# Altium schematic sheet Esquematico_Luximetro.SchDoc
size A4
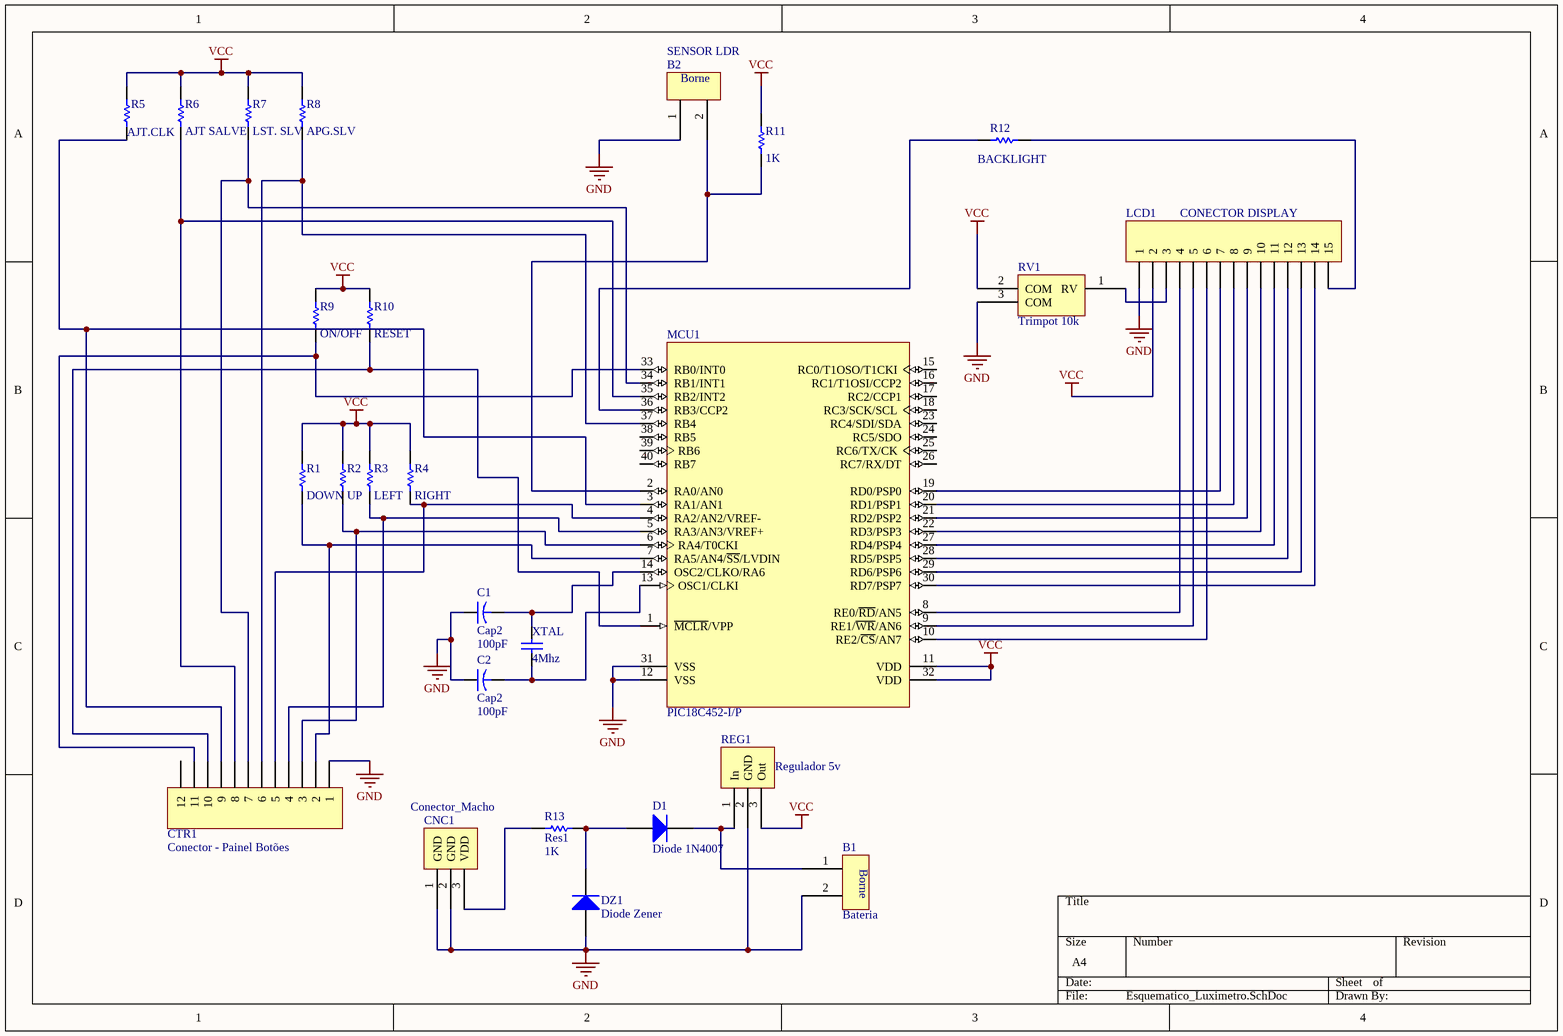
[diagram p0: Esquematico_Luximetro.SchDoc]

## Parts
B1  Bateria  [PCB_BORNE]
B2  SENSOR LDR  [PCB_BORNE]
C1  Cap2  value 100pF  [CAPR5-4X5]
C2  Cap2  value 100pF  [CAPR5-4X5]
CNC1  Conector_Macho  [PCB_Conector]
CTR1  Conector - Painel Botões  [HDR1X12]
D1  Diode 1N4007  [DO-41]
DZ1  Diode Zener  [DO-41]
LCD1  CONECTOR DISPLAY  [HDR1X15]
MCU1  PIC18C452-I/P  [PDIP600-40]
R1  value DOWN  [AXIAL-0.3]  (hidden comment: Res2)
R2  value UP  [AXIAL-0.3]  (hidden comment: Res3)
R3  value LEFT  [AXIAL-0.3]  (hidden comment: Res4)
R4  value RIGHT  [AXIAL-0.3]  (hidden comment: Res5)
R5  value AJT.CLK  [AXIAL-0.3]  (hidden comment: Res1)
R6  value AJT SALVE  [AXIAL-0.3]  (hidden comment: Res1)
R7  value LST. SLV  [AXIAL-0.3]  (hidden comment: Res1)
R8  value APG.SLV  [AXIAL-0.3]  (hidden comment: Res1)
R9  value ON/OFF  [AXIAL-0.3]  (hidden comment: Res1)
R10  value RESET  [AXIAL-0.3]  (hidden comment: Res1)
R11  value 1K  [AXIAL-0.3]  (hidden comment: Res5)
R12  BACKLIGHT  [AXIAL-0.3]
R13  Res1  value 1K  [AXIAL-0.3]
REG1  Regulador 5v  [PCB_CI7805]
RV1  Trimpot 10k  [PCB_TRIMPOT]
XTAL  value 4Mhz  [RAD-0.3]  (hidden comment: Cap)

## Nets
GND: B1.2 B2.1 C1.1 C2.1 CNC1.1(GND) CNC1.2(GND) CTR1.1 DZ1.1(A) LCD1.1 MCU1.12(VSS) MCU1.31(VSS) REG1.2(GND) RV1.3(COM)
VCC: LCD1.2 MCU1.11(VDD) MCU1.32(VDD) R1.1 R2.1 R3.1 R4.1 R5.2 R6.2 R7.2 R8.2 R9.1 R10.1 R11.1 REG1.3(Out) RV1.2(COM)
NetB1_1: B1.1 D1.2(K) REG1.1(In)
NetB2_2: B2.2 MCU1.2(RA0/AN0) R11.2
NetC1_2: C1.2 MCU1.14(OSC2/CLKO/RA6) XTAL.2
NetC2_2: C2.2 MCU1.13(OSC1/CLKI) XTAL.1
NetCNC1_3: CNC1.3(VDD) R13.1
NetCTR1_2: CTR1.2 MCU1.7(RA5/AN4/~{SS}/LVDIN) R1.2
NetCTR1_3: CTR1.3 MCU1.6(RA4/T0CKI) R2.2
NetCTR1_4: CTR1.4 MCU1.5(RA3/AN3/VREF+) R3.2
NetCTR1_5: CTR1.5 MCU1.4(RA2/AN2/VREF-) R4.2
NetCTR1_6: CTR1.6 MCU1.37(RB4) R8.1
NetCTR1_7: CTR1.7 MCU1.34(RB1/INT1) R7.1
NetCTR1_8: CTR1.8 MCU1.35(RB2/INT2) R6.1
NetCTR1_9: CTR1.9 MCU1.3(RA1/AN1) R5.1
NetCTR1_10: CTR1.10 MCU1.1(~{MCLR}/VPP) R10.2
NetCTR1_11: CTR1.11 MCU1.33(RB0/INT0) R9.2
NetD1_1: D1.1(A) DZ1.2(K) R13.2
NetLCD1_3: LCD1.3 RV1.1(RV)
NetLCD1_4: LCD1.4 MCU1.8(RE0/~{RD}/AN5)
NetLCD1_5: LCD1.5 MCU1.9(RE1/~{WR}/AN6)
NetLCD1_6: LCD1.6 MCU1.10(RE2/~{CS}/AN7)
NetLCD1_7: LCD1.7 MCU1.19(RD0/PSP0)
NetLCD1_8: LCD1.8 MCU1.20(RD1/PSP1)
NetLCD1_9: LCD1.9 MCU1.21(RD2/PSP2)
NetLCD1_10: LCD1.10 MCU1.22(RD3/PSP3)
NetLCD1_11: LCD1.11 MCU1.27(RD4/PSP4)
NetLCD1_12: LCD1.12 MCU1.28(RD5/PSP5)
NetLCD1_13: LCD1.13 MCU1.29(RD6/PSP6)
NetLCD1_14: LCD1.14 MCU1.30(RD7/PSP7)
NetLCD1_15: LCD1.15 R12.2
NetMCU1_36: MCU1.36(RB3/CCP2) R12.1

Not connected (* = marked no-connect by the designer): CTR1 12; MCU1 15(RC0/T1OSO/T1CKI) 16(RC1/T1OSI/CCP2) 17(RC2/CCP1) 18(RC3/SCK/SCL) 23(RC4/SDI/SDA) 24(RC5/SDO) 25(RC6/TX/CK) 26(RC7/RX/DT) 38(RB5) 39(RB6) 40(RB7)

## Library data of the parts
B1 B2 = Borne
C1 C2 = Cap2: Capacitor; Published: 23-Sep-2002; PackageReference: CAPR5-4X5; Publisher: Altium Limited
CNC1 = Conector
CTR1 = Header 12: Header, 12-Pin; LatestRevisionDate: 17-Jul-2002; LatestRevisionNote: Re-released for DXP Platform.; Publisher: Altium Limited
D1 DZ1 = Diode 1N4007: 1 Amp General Purpose Rectifier; Published: 8-Jun-2000; LatestRevisionDate: 17-Jul-2002; LatestRevisionNote: Re-released for DXP Platform.; DatasheetDocument: 1998; PackageDocument: Aug-1999; PackageReference: DO-41; Publisher: Altium Limited; Code_JEDEC: DO-204-AL; ComponentLink1Description: Manufacturer Link; ComponentLink1URL: http://www.fairchildsemi.com/; ComponentLink2Description: Datasheet; ComponentLink2URL: http://www.fairchildsemi.com/ds/1N%2F1N4001.pdf
LCD1 = Header 15: Header, 15-Pin; LatestRevisionDate: 17-Jul-2002; LatestRevisionNote: Re-released for DXP Platform.; Publisher: Altium Limited
MCU1 = PIC18C452-I/P: High Performance Microcontroller with 10-Bit A/D, 32K EPROM, 40-Pin PDIP, Standard Volt Range, Industrial Temperature; Note: Pin compatible with 40-pin PIC16C7X devices.; Note: Not recommended for new designs. Consider PIC18F452 instead.; Note: RB3 is the alternate pin for the CCP2 pin multiplexing.; Published: 11-Oct-2004; LatestRevisionDate: 04-Mar-2005; LatestRevisionNote: Stylized 3D Model Added.; DatasheetVersion: DS39026C_2001; PackageVersion: 2003; PackageReference: PDIP600-40; Publisher: Altium Limited; PackageDescription: DIP, Plastic; 40 Leads; Row Spacing 15.24 mm; Pitch 2.54 mm; Code_JEDEC: MO-011; ComponentLink1Description: Manufacturer Link; ComponentLink1URL: http://www.microchip.com; ComponentLink2Description: Datasheet; ComponentLink2URL: http://ww1.microchip.com/downloads/en/DeviceDoc/39026c.pdf; ComponentLink3Description: Packaging Specification; ComponentLink3URL: http://ww1.microchip.com/downloads/en/PackagingSpec/00049AD.pdf
R1-R11 R13 = Res1: Resistor; Published: 8-Jun-2000; LatestRevisionDate: 17-Jul-2002; LatestRevisionNote: Re-released for DXP Platform.; PackageReference: AXIAL-0.3; Publisher: Altium Limited
R12 = Res1: Resistor; Value: 1K; Published: 8-Jun-2000; LatestRevisionDate: 17-Jul-2002; LatestRevisionNote: Re-released for DXP Platform.; PackageReference: AXIAL-0.3; Publisher: Altium Limited
REG1 = Regulador
RV1 = Trimpot
XTAL = Cap: Capacitor; Published: 8-Jun-2000; LatestRevisionDate: 17-Jul-2002; LatestRevisionNote: Re-released for DXP Platform.; PackageReference: RAD-0.3; Publisher: Altium Limited